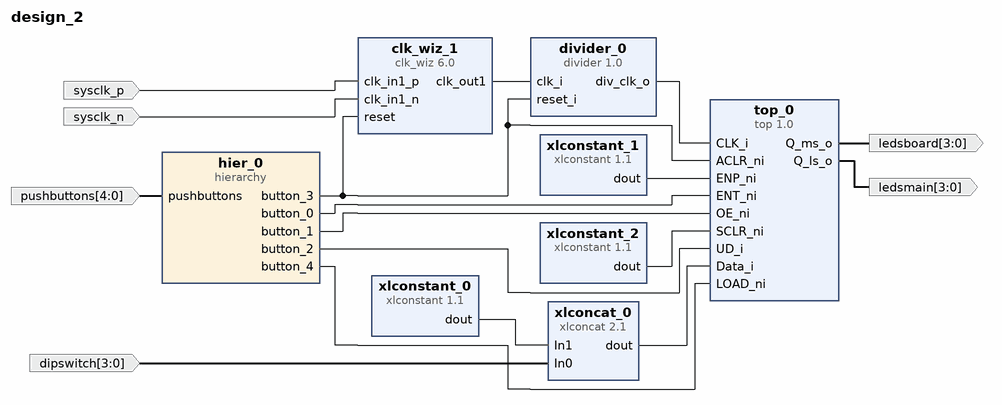
[diagram p0: block diagram of the top level]
# Vivado block design design_2, xc7a200tfbg676-2, Vivado 2018.2
create_bd_design design_2

create_bd_port -dir I -type clk sysclk_p
set_property -dict {CONFIG.FREQ_HZ 200000000} [get_bd_ports sysclk_p]
create_bd_port -dir I -type clk sysclk_n
set_property -dict {CONFIG.FREQ_HZ 200000000} [get_bd_ports sysclk_n]
create_bd_port -dir I -from 4 -to 0 -type data pushbuttons
create_bd_port -dir O -from 3 -to 0 -type data ledsmain
create_bd_port -dir O -from 3 -to 0 -type data ledsboard
create_bd_port -dir I -from 3 -to 0 -type data dipswitch

create_bd_cell -type ip -vlnv xilinx.com:ip:clk_wiz:6.0 clk_wiz_1
set_property -dict [list \
  CONFIG.PRIMITIVE MMCM \
  CONFIG.PRIM_IN_FREQ 200.000 \
  CONFIG.CLKIN1_JITTER_PS 50.0 \
  CONFIG.CLKOUT1_REQUESTED_OUT_FREQ 5 \
  CONFIG.PRIM_SOURCE Differential_clock_capable_pin \
  CONFIG.CLKOUT1_DRIVES BUFG \
  CONFIG.CLKOUT2_DRIVES BUFG \
  CONFIG.CLKOUT3_DRIVES BUFG \
  CONFIG.CLKOUT4_DRIVES BUFG \
  CONFIG.CLKOUT5_DRIVES BUFG \
  CONFIG.CLKOUT6_DRIVES BUFG \
  CONFIG.CLKOUT7_DRIVES BUFG \
  CONFIG.FEEDBACK_SOURCE FDBK_AUTO \
  CONFIG.USE_LOCKED false \
  CONFIG.MMCM_DIVCLK_DIVIDE 5 \
  CONFIG.MMCM_CLKFBOUT_MULT_F 16.000 \
  CONFIG.MMCM_CLKIN1_PERIOD 5.000 \
  CONFIG.MMCM_CLKIN2_PERIOD 10.0 \
  CONFIG.MMCM_COMPENSATION ZHOLD \
  CONFIG.MMCM_CLKOUT0_DIVIDE_F 128.000 \
  CONFIG.CLK_IN1_BOARD_INTERFACE sys_diff_clock \
  CONFIG.CLKOUT1_JITTER 394.366 \
  CONFIG.CLKOUT1_PHASE_ERROR 179.338 \
] [get_bd_cells clk_wiz_1]
create_bd_cell -type hier hier_0
create_bd_cell -type ip -vlnv xilinx.com:ip:xlconstant:1.1 xlconstant_0
set_property -dict {CONFIG.CONST_WIDTH 4 CONFIG.CONST_VAL 8} [get_bd_cells xlconstant_0]
create_bd_cell -type ip -vlnv xilinx.com:ip:xlconstant:1.1 xlconstant_1
set_property -dict {CONFIG.CONST_VAL 0} [get_bd_cells xlconstant_1]
create_bd_cell -type ip -vlnv xilinx.com:user:top:1.0 top_0
create_bd_cell -type ip -vlnv xilinx.com:ip:xlconcat:2.1 xlconcat_0
set_property -dict {CONFIG.IN0_WIDTH 4 CONFIG.IN1_WIDTH 4} [get_bd_cells xlconcat_0]
create_bd_cell -type ip -vlnv xilinx.com:user:divider:1.0 divider_0
create_bd_cell -type ip -vlnv xilinx.com:ip:xlconstant:1.1 xlconstant_2

# ---- hierarchy /hier_0 ----
current_bd_instance /hier_0
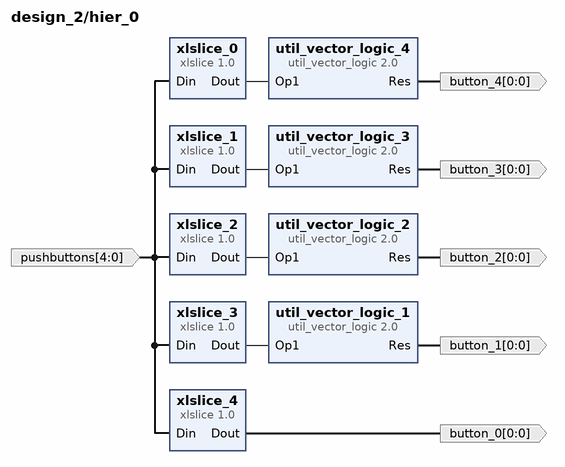
[diagram p1: block diagram inside /hier_0]
create_bd_pin -dir I -from 4 -to 0 pushbuttons
create_bd_pin -dir O -from 0 -to 0 button_4
create_bd_pin -dir O -from 0 -to 0 button_3
create_bd_pin -dir O -from 0 -to 0 button_2
create_bd_pin -dir O -from 0 -to 0 button_1
create_bd_pin -dir O -from 0 -to 0 button_0

create_bd_cell -type ip -vlnv xilinx.com:ip:xlslice:1.0 xlslice_1
set_property -dict {CONFIG.DIN_TO 3 CONFIG.DIN_FROM 3 CONFIG.DIN_WIDTH 5 CONFIG.DOUT_WIDTH 1} [get_bd_cells xlslice_1]
create_bd_cell -type ip -vlnv xilinx.com:ip:xlslice:1.0 xlslice_2
set_property -dict {CONFIG.DIN_TO 2 CONFIG.DIN_FROM 2 CONFIG.DIN_WIDTH 5 CONFIG.DOUT_WIDTH 1} [get_bd_cells xlslice_2]
create_bd_cell -type ip -vlnv xilinx.com:ip:xlslice:1.0 xlslice_3
set_property -dict {CONFIG.DIN_TO 1 CONFIG.DIN_FROM 1 CONFIG.DIN_WIDTH 5 CONFIG.DOUT_WIDTH 1} [get_bd_cells xlslice_3]
create_bd_cell -type ip -vlnv xilinx.com:ip:xlslice:1.0 xlslice_4
set_property -dict {CONFIG.DIN_TO 0 CONFIG.DIN_FROM 0 CONFIG.DIN_WIDTH 5 CONFIG.DOUT_WIDTH 1} [get_bd_cells xlslice_4]
create_bd_cell -type ip -vlnv xilinx.com:ip:xlslice:1.0 xlslice_0
set_property -dict {CONFIG.DIN_TO 4 CONFIG.DIN_FROM 4 CONFIG.DIN_WIDTH 5 CONFIG.DOUT_WIDTH 1} [get_bd_cells xlslice_0]
create_bd_cell -type ip -vlnv xilinx.com:ip:util_vector_logic:2.0 util_vector_logic_1
set_property -dict {CONFIG.C_SIZE 1 CONFIG.C_OPERATION not} [get_bd_cells util_vector_logic_1]
create_bd_cell -type ip -vlnv xilinx.com:ip:util_vector_logic:2.0 util_vector_logic_2
set_property -dict {CONFIG.C_SIZE 1 CONFIG.C_OPERATION not} [get_bd_cells util_vector_logic_2]
create_bd_cell -type ip -vlnv xilinx.com:ip:util_vector_logic:2.0 util_vector_logic_3
set_property -dict {CONFIG.C_SIZE 1 CONFIG.C_OPERATION not} [get_bd_cells util_vector_logic_3]
create_bd_cell -type ip -vlnv xilinx.com:ip:util_vector_logic:2.0 util_vector_logic_4
set_property -dict {CONFIG.C_SIZE 1 CONFIG.C_OPERATION not} [get_bd_cells util_vector_logic_4]

# ---- connections ----

current_bd_instance /hier_0
connect_bd_net [get_bd_pins pushbuttons] \
  [get_bd_pins xlslice_0/Din] [get_bd_pins xlslice_2/Din] [get_bd_pins xlslice_3/Din] [get_bd_pins xlslice_4/Din] \
  [get_bd_pins xlslice_1/Din]
connect_bd_net [get_bd_pins xlslice_3/Dout] [get_bd_pins util_vector_logic_1/Op1]
connect_bd_net [get_bd_pins xlslice_2/Dout] [get_bd_pins util_vector_logic_2/Op1]
connect_bd_net [get_bd_pins xlslice_1/Dout] [get_bd_pins util_vector_logic_3/Op1]
connect_bd_net [get_bd_pins xlslice_0/Dout] [get_bd_pins util_vector_logic_4/Op1]
connect_bd_net [get_bd_pins util_vector_logic_4/Res] [get_bd_pins button_4]
connect_bd_net [get_bd_pins util_vector_logic_3/Res] [get_bd_pins button_3]
connect_bd_net [get_bd_pins util_vector_logic_2/Res] [get_bd_pins button_2]
connect_bd_net [get_bd_pins util_vector_logic_1/Res] [get_bd_pins button_1]
connect_bd_net [get_bd_pins xlslice_4/Dout] [get_bd_pins button_0]

current_bd_instance /
connect_bd_net [get_bd_ports sysclk_p] [get_bd_pins clk_wiz_1/clk_in1_p]
connect_bd_net [get_bd_ports sysclk_n] [get_bd_pins clk_wiz_1/clk_in1_n]
connect_bd_net [get_bd_ports pushbuttons] [get_bd_pins hier_0/pushbuttons]
connect_bd_net [get_bd_pins top_0/Q_ls_o] [get_bd_ports ledsmain]
connect_bd_net [get_bd_pins top_0/Q_ms_o] [get_bd_ports ledsboard]
connect_bd_net [get_bd_pins xlconstant_1/dout] [get_bd_pins top_0/ENP_ni]
connect_bd_net [get_bd_pins hier_0/button_0] [get_bd_pins top_0/ENT_ni]
connect_bd_net [get_bd_pins hier_0/button_1] [get_bd_pins top_0/OE_ni]
connect_bd_net [get_bd_pins hier_0/button_2] [get_bd_pins top_0/UD_i]
connect_bd_net [get_bd_pins hier_0/button_4] [get_bd_pins top_0/LOAD_ni]
connect_bd_net [get_bd_ports dipswitch] [get_bd_pins xlconcat_0/In0]
connect_bd_net [get_bd_pins xlconstant_0/dout] [get_bd_pins xlconcat_0/In1]
connect_bd_net [get_bd_pins xlconcat_0/dout] [get_bd_pins top_0/Data_i]
connect_bd_net [get_bd_pins clk_wiz_1/clk_out1] [get_bd_pins divider_0/clk_i]
connect_bd_net [get_bd_pins divider_0/div_clk_o] [get_bd_pins top_0/CLK_i]
connect_bd_net [get_bd_pins hier_0/button_3] [get_bd_pins top_0/ACLR_ni] [get_bd_pins divider_0/reset_i] [get_bd_pins clk_wiz_1/reset]
connect_bd_net [get_bd_pins xlconstant_2/dout] [get_bd_pins top_0/SCLR_ni]

validate_bd_design
save_bd_design
